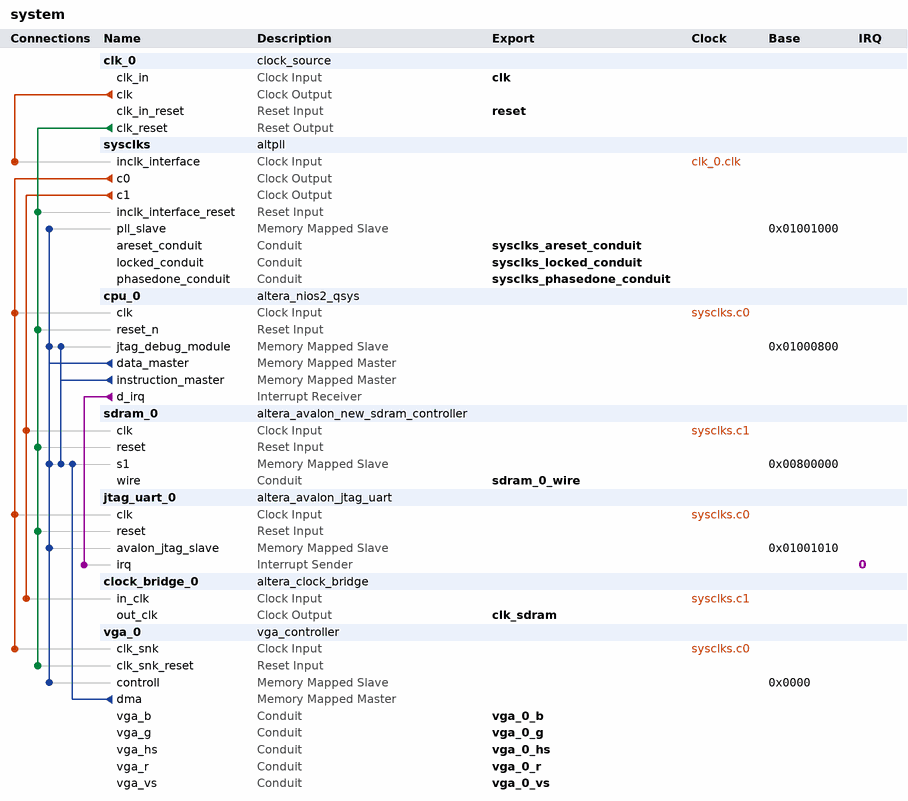
[diagram p0: system contents]
# Platform Designer (Qsys) system system, Cyclone III Unknown
# Parameters at their usual value, and those the tool derives, are not listed.
package require -exact qsys 13.0
create_system system
set_project_property DEVICE_FAMILY {Cyclone III}
set_project_property DEVICE Unknown

add_instance clk_0 clock_source 13.0
set_instance_parameter_value clk_0 clockFrequency 50000000

add_instance sysclks altpll 13.0
set_instance_parameter_value sysclks INCLK0_INPUT_FREQUENCY 20000
set_instance_parameter_value sysclks CLK0_MULTIPLY_BY 1
set_instance_parameter_value sysclks CLK1_MULTIPLY_BY 1
set_instance_parameter_value sysclks CLK0_DIVIDE_BY 1
set_instance_parameter_value sysclks CLK1_DIVIDE_BY 1
set_instance_parameter_value sysclks CLK1_PHASE_SHIFT -3000
set_instance_parameter_value sysclks CLK1_DUTY_CYCLE 50
set_instance_parameter_value sysclks PORT_clk1 PORT_USED
set_instance_parameter_value sysclks PORT_clk2 PORT_UNUSED
set_instance_parameter_value sysclks PORT_clk3 PORT_UNUSED
set_instance_parameter_value sysclks PORT_ARESET PORT_USED
set_instance_parameter_value sysclks PORT_LOCKED PORT_USED

add_instance cpu_0 altera_nios2_qsys 13.0
set_instance_parameter_value cpu_0 muldiv_divider true
set_instance_parameter_value cpu_0 resetSlave sdram_0.s1
set_instance_parameter_value cpu_0 exceptionSlave sdram_0.s1
set_instance_parameter_value cpu_0 breakSlave cpu_0.jtag_debug_module
set_instance_parameter_value cpu_0 impl Small
set_instance_parameter_value cpu_0 icache_size 4096

add_instance sdram_0 altera_avalon_new_sdram_controller 13.0.1.99.2
set_instance_parameter_value sdram_0 TAC 5.5
set_instance_parameter_value sdram_0 TRCD 20.0
set_instance_parameter_value sdram_0 TRP 20.0
set_instance_parameter_value sdram_0 casLatency 3
set_instance_parameter_value sdram_0 columnWidth 8
set_instance_parameter_value sdram_0 dataWidth 16
set_instance_parameter_value sdram_0 generateSimulationModel false
set_instance_parameter_value sdram_0 model custom
set_instance_parameter_value sdram_0 numberOfBanks 4
set_instance_parameter_value sdram_0 numberOfChipSelects 1
set_instance_parameter_value sdram_0 powerUpDelay 100.0
set_instance_parameter_value sdram_0 refreshPeriod 15.625
set_instance_parameter_value sdram_0 rowWidth 12

add_instance jtag_uart_0 altera_avalon_jtag_uart 13.0.1.99.2
set_instance_parameter_value jtag_uart_0 simInteractiveOptions INTERACTIVE_ASCII_OUTPUT

add_instance clock_bridge_0 altera_clock_bridge 13.0
set_instance_parameter_value clock_bridge_0 DERIVED_CLOCK_RATE 50000000
set_instance_parameter_value clock_bridge_0 EXPLICIT_CLOCK_RATE 0

add_instance vga_0 vga_controller 1.3

# connections
add_connection clk_0.clk sysclks.inclk_interface clock
add_connection sysclks.c0 cpu_0.clk clock
add_connection sysclks.c0 jtag_uart_0.clk clock
add_connection sysclks.c0 vga_0.clk_snk clock
add_connection sysclks.c1 clock_bridge_0.in_clk clock
add_connection sysclks.c1 sdram_0.clk clock
add_connection clk_0.clk_reset cpu_0.reset_n reset
add_connection clk_0.clk_reset jtag_uart_0.reset reset
add_connection clk_0.clk_reset sdram_0.reset reset
add_connection clk_0.clk_reset sysclks.inclk_interface_reset reset
add_connection clk_0.clk_reset vga_0.clk_snk_reset reset
add_connection cpu_0.data_master cpu_0.jtag_debug_module avalon
set_connection_parameter_value cpu_0.data_master/cpu_0.jtag_debug_module baseAddress 0x01000800
add_connection cpu_0.data_master jtag_uart_0.avalon_jtag_slave avalon
set_connection_parameter_value cpu_0.data_master/jtag_uart_0.avalon_jtag_slave baseAddress 0x01001010
add_connection cpu_0.data_master sdram_0.s1 avalon
set_connection_parameter_value cpu_0.data_master/sdram_0.s1 baseAddress 0x00800000
add_connection cpu_0.data_master sysclks.pll_slave avalon
set_connection_parameter_value cpu_0.data_master/sysclks.pll_slave baseAddress 0x01001000
add_connection cpu_0.data_master vga_0.controll avalon
set_connection_parameter_value cpu_0.data_master/vga_0.controll baseAddress 0x0000
add_connection cpu_0.instruction_master cpu_0.jtag_debug_module avalon
set_connection_parameter_value cpu_0.instruction_master/cpu_0.jtag_debug_module baseAddress 0x01000800
add_connection cpu_0.instruction_master sdram_0.s1 avalon
set_connection_parameter_value cpu_0.instruction_master/sdram_0.s1 baseAddress 0x00800000
add_connection vga_0.dma sdram_0.s1 avalon
set_connection_parameter_value vga_0.dma/sdram_0.s1 baseAddress 0x00800000
add_connection cpu_0.d_irq jtag_uart_0.irq interrupt
set_connection_parameter_value cpu_0.d_irq/jtag_uart_0.irq irqNumber 0

# exported interfaces
add_interface clk clock sink
set_interface_property clk EXPORT_OF clk_0.clk_in
add_interface reset reset sink
set_interface_property reset EXPORT_OF clk_0.clk_in_reset
add_interface sysclks_areset_conduit conduit end
set_interface_property sysclks_areset_conduit EXPORT_OF sysclks.areset_conduit
add_interface sysclks_locked_conduit conduit end
set_interface_property sysclks_locked_conduit EXPORT_OF sysclks.locked_conduit
add_interface sysclks_phasedone_conduit conduit end
set_interface_property sysclks_phasedone_conduit EXPORT_OF sysclks.phasedone_conduit
add_interface sdram_0_wire conduit end
set_interface_property sdram_0_wire EXPORT_OF sdram_0.wire
add_interface clk_sdram clock source
set_interface_property clk_sdram EXPORT_OF clock_bridge_0.out_clk
add_interface vga_0_hs conduit end
set_interface_property vga_0_hs EXPORT_OF vga_0.vga_hs
add_interface vga_0_r conduit end
set_interface_property vga_0_r EXPORT_OF vga_0.vga_r
add_interface vga_0_vs conduit end
set_interface_property vga_0_vs EXPORT_OF vga_0.vga_vs
add_interface vga_0_g conduit end
set_interface_property vga_0_g EXPORT_OF vga_0.vga_g
add_interface vga_0_b conduit end
set_interface_property vga_0_b EXPORT_OF vga_0.vga_b

set_interconnect_requirement {$system} qsys_mm.clockCrossingAdapter HANDSHAKE
set_interconnect_requirement {$system} qsys_mm.maxAdditionalLatency 1

save_system system.qsys
